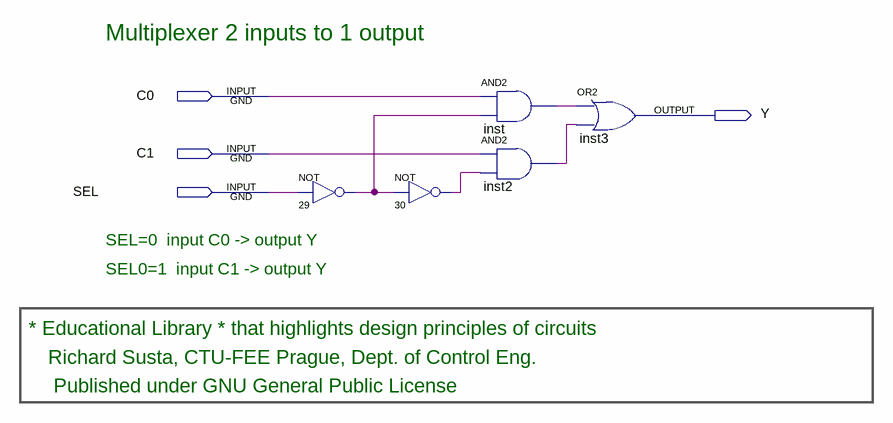
[diagram p0: schematic sheet]
// Quartus schematic mux2to1.bdf as structural Verilog: 5 symbols, 4 pins
module mux2to1 (
  input  C0,
  input  C1,
  input  SEL,
  output Y
);

  wire inst2_out, inst_out, n29_out, n30_out;

  not u_29 (n29_out, SEL);
  not u_30 (n30_out, n29_out);
  and inst (inst_out, C0, n29_out);
  and inst2 (inst2_out, C1, n30_out);
  or inst3 (Y, inst_out, inst2_out);

  // Notes on the sheet:
  //   Multiplexer 2 inputs to 1 output
  //   SEL=0  input C0 -> output Y
  //   SEL0=1  input C1 -> output Y
  //   * Educational Library * that highlights design principles of circuits
  //   Richard Susta, CTU-FEE Prague, Dept. of Control Eng. 
  //    Published under GNU General Public License
endmodule
